# Altium schematic sheet Pcb_teensy_swarm_robotics_schematic.SchDoc: Placa de módulos
size Letter; Date: Julio-2017; Author: William Abel Orozco Cifuentes; Organization: Universidad Del Valle De Guatemala; Curso: Proyecto 3 de electrónica
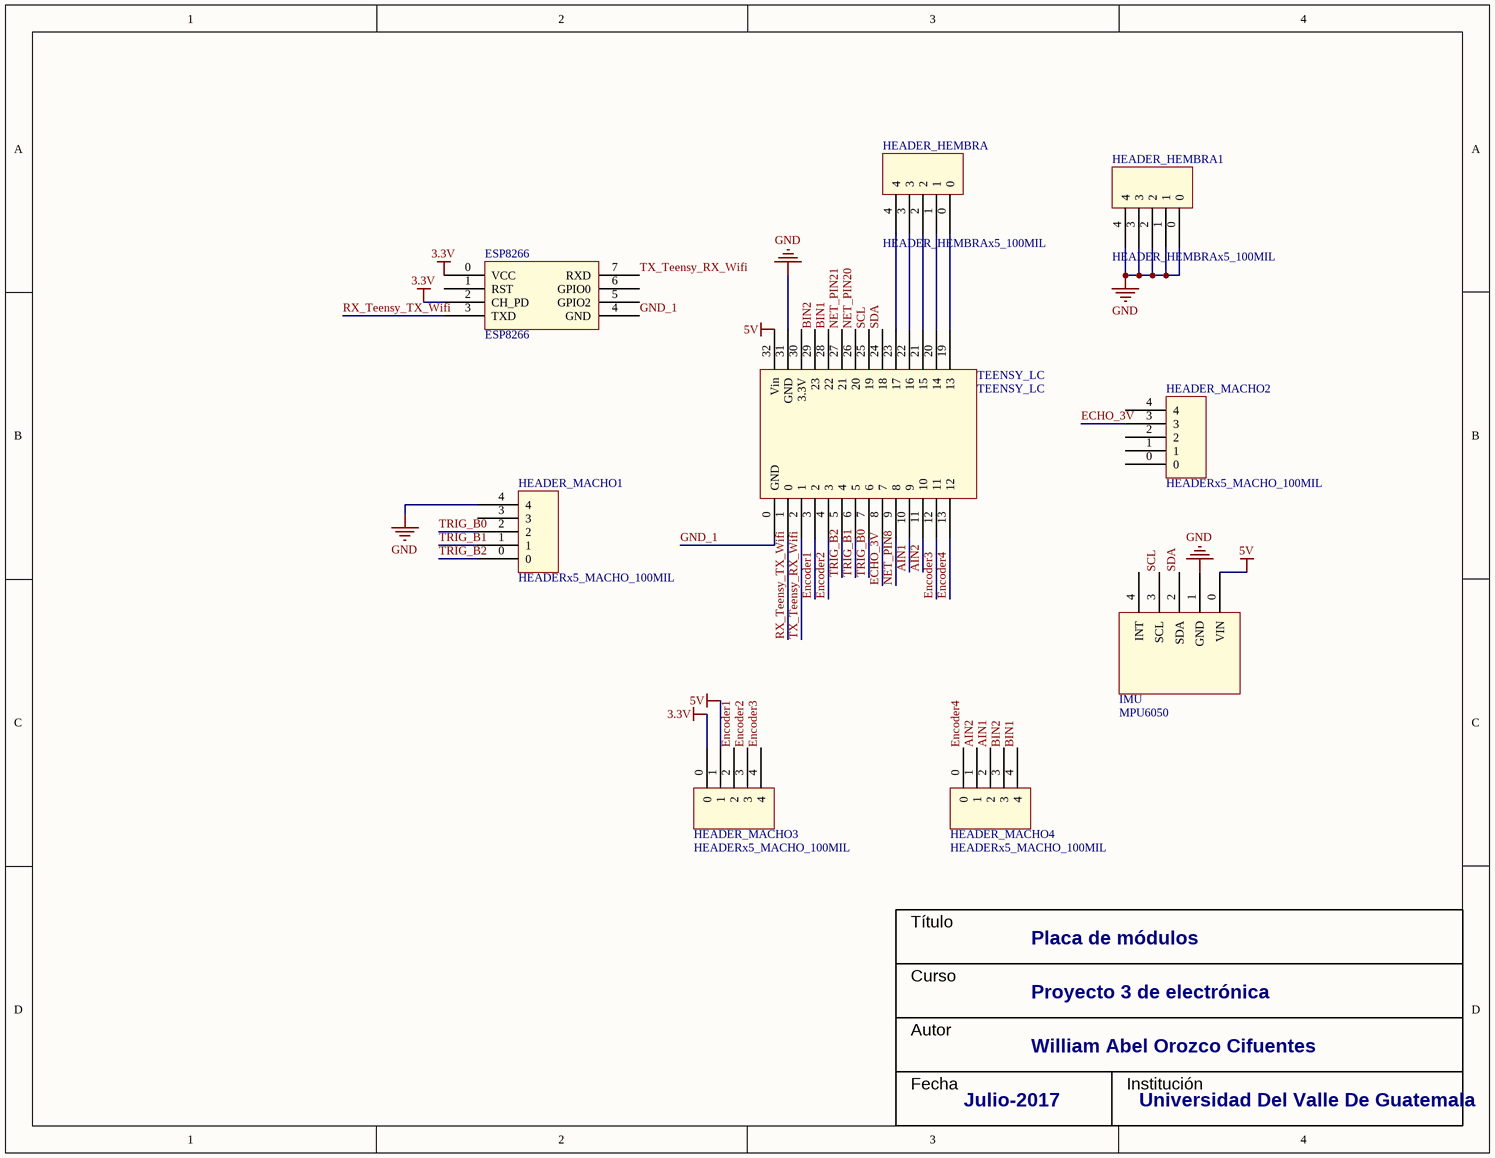
[diagram p0: Pcb_teensy_swarm_robotics_schematic.SchDoc]

## Parts
ESP8266  ESP8266  [ESP8266]
HEADER_HEMBRA  HEADER_HEMBRAx5_100MIL  [HDRx5HEMBRA_FOOTPRINT]
HEADER_HEMBRA1  HEADER_HEMBRAx5_100MIL  [HDRx5HEMBRA_FOOTPRINT]
HEADER_MACHO1  HEADERx5_MACHO_100MIL  [HEADERx5_MACHO_FOOTPRINT]
HEADER_MACHO2  HEADERx5_MACHO_100MIL  [HEADERx5_MACHO_FOOTPRINT]
HEADER_MACHO3  HEADERx5_MACHO_100MIL  [HEADERx5_MACHO_FOOTPRINT]
HEADER_MACHO4  HEADERx5_MACHO_100MIL  [HEADERx5_MACHO_FOOTPRINT]
IMU  MPU6050  [IMU_]
TEENSY_LC  TEENSY_LC  [TEENSY_LC]

## Nets
3.3V: ESP8266.0(VCC) ESP8266.2(CH_PD) HEADER_MACHO3.0
5V: HEADER_MACHO3.1 IMU.0(VIN) TEENSY_LC.32(Vin)
GND: HEADER_HEMBRA1.0 HEADER_HEMBRA1.1 HEADER_HEMBRA1.2 HEADER_HEMBRA1.3 HEADER_HEMBRA1.4 HEADER_MACHO1.4 IMU.1(GND) TEENSY_LC.31(GND)
AIN1: HEADER_MACHO4.2 TEENSY_LC.10(9)
AIN2: HEADER_MACHO4.1 TEENSY_LC.11(10)
BIN1: HEADER_MACHO4.4 TEENSY_LC.28(22)
BIN2: HEADER_MACHO4.3 TEENSY_LC.29(23)
ECHO_3V: HEADER_MACHO2.3 TEENSY_LC.8(7)
Encoder1: HEADER_MACHO3.2 TEENSY_LC.3(2)
Encoder2: HEADER_MACHO3.3 TEENSY_LC.4(3)
Encoder3: HEADER_MACHO3.4 TEENSY_LC.12(11)
Encoder4: HEADER_MACHO4.0 TEENSY_LC.13(12)
GND_1: ESP8266.4(GND) TEENSY_LC.0(GND)
NET_PIN8: TEENSY_LC.9(8)
NET_PIN20: TEENSY_LC.26(20)
NET_PIN21: TEENSY_LC.27(21)
RX_Teensy_TX_Wifi: ESP8266.3(TXD) TEENSY_LC.1(0)
SCL: IMU.3(SCL) TEENSY_LC.25(19)
SDA: IMU.2(SDA) TEENSY_LC.24(18)
TRIG_B0: HEADER_MACHO1.2 TEENSY_LC.7(6)
TRIG_B1: HEADER_MACHO1.1 TEENSY_LC.6(5)
TRIG_B2: HEADER_MACHO1.0 TEENSY_LC.5(4)
TX_Teensy_RX_Wifi: ESP8266.7(RXD) TEENSY_LC.2(1)
NetHEADER_HEMBRA_0: HEADER_HEMBRA.0 TEENSY_LC.19(13)
NetHEADER_HEMBRA_1: HEADER_HEMBRA.1 TEENSY_LC.20(14)
NetHEADER_HEMBRA_2: HEADER_HEMBRA.2 TEENSY_LC.21(15)
NetHEADER_HEMBRA_3: HEADER_HEMBRA.3 TEENSY_LC.22(16)
NetHEADER_HEMBRA_4: HEADER_HEMBRA.4 TEENSY_LC.23(17)

Not connected (* = marked no-connect by the designer): ESP8266 1(RST) 5(GPIO2) 6(GPIO0); HEADER_MACHO1 3; HEADER_MACHO2 0 1 2 4; IMU 4(INT); TEENSY_LC 30(3.3V)

## Notes on the sheet
- Título
- Autor
- Curso
- Fecha
- Institución